# EAGLE design remote_0.1 (EAGLE 7.7.0)
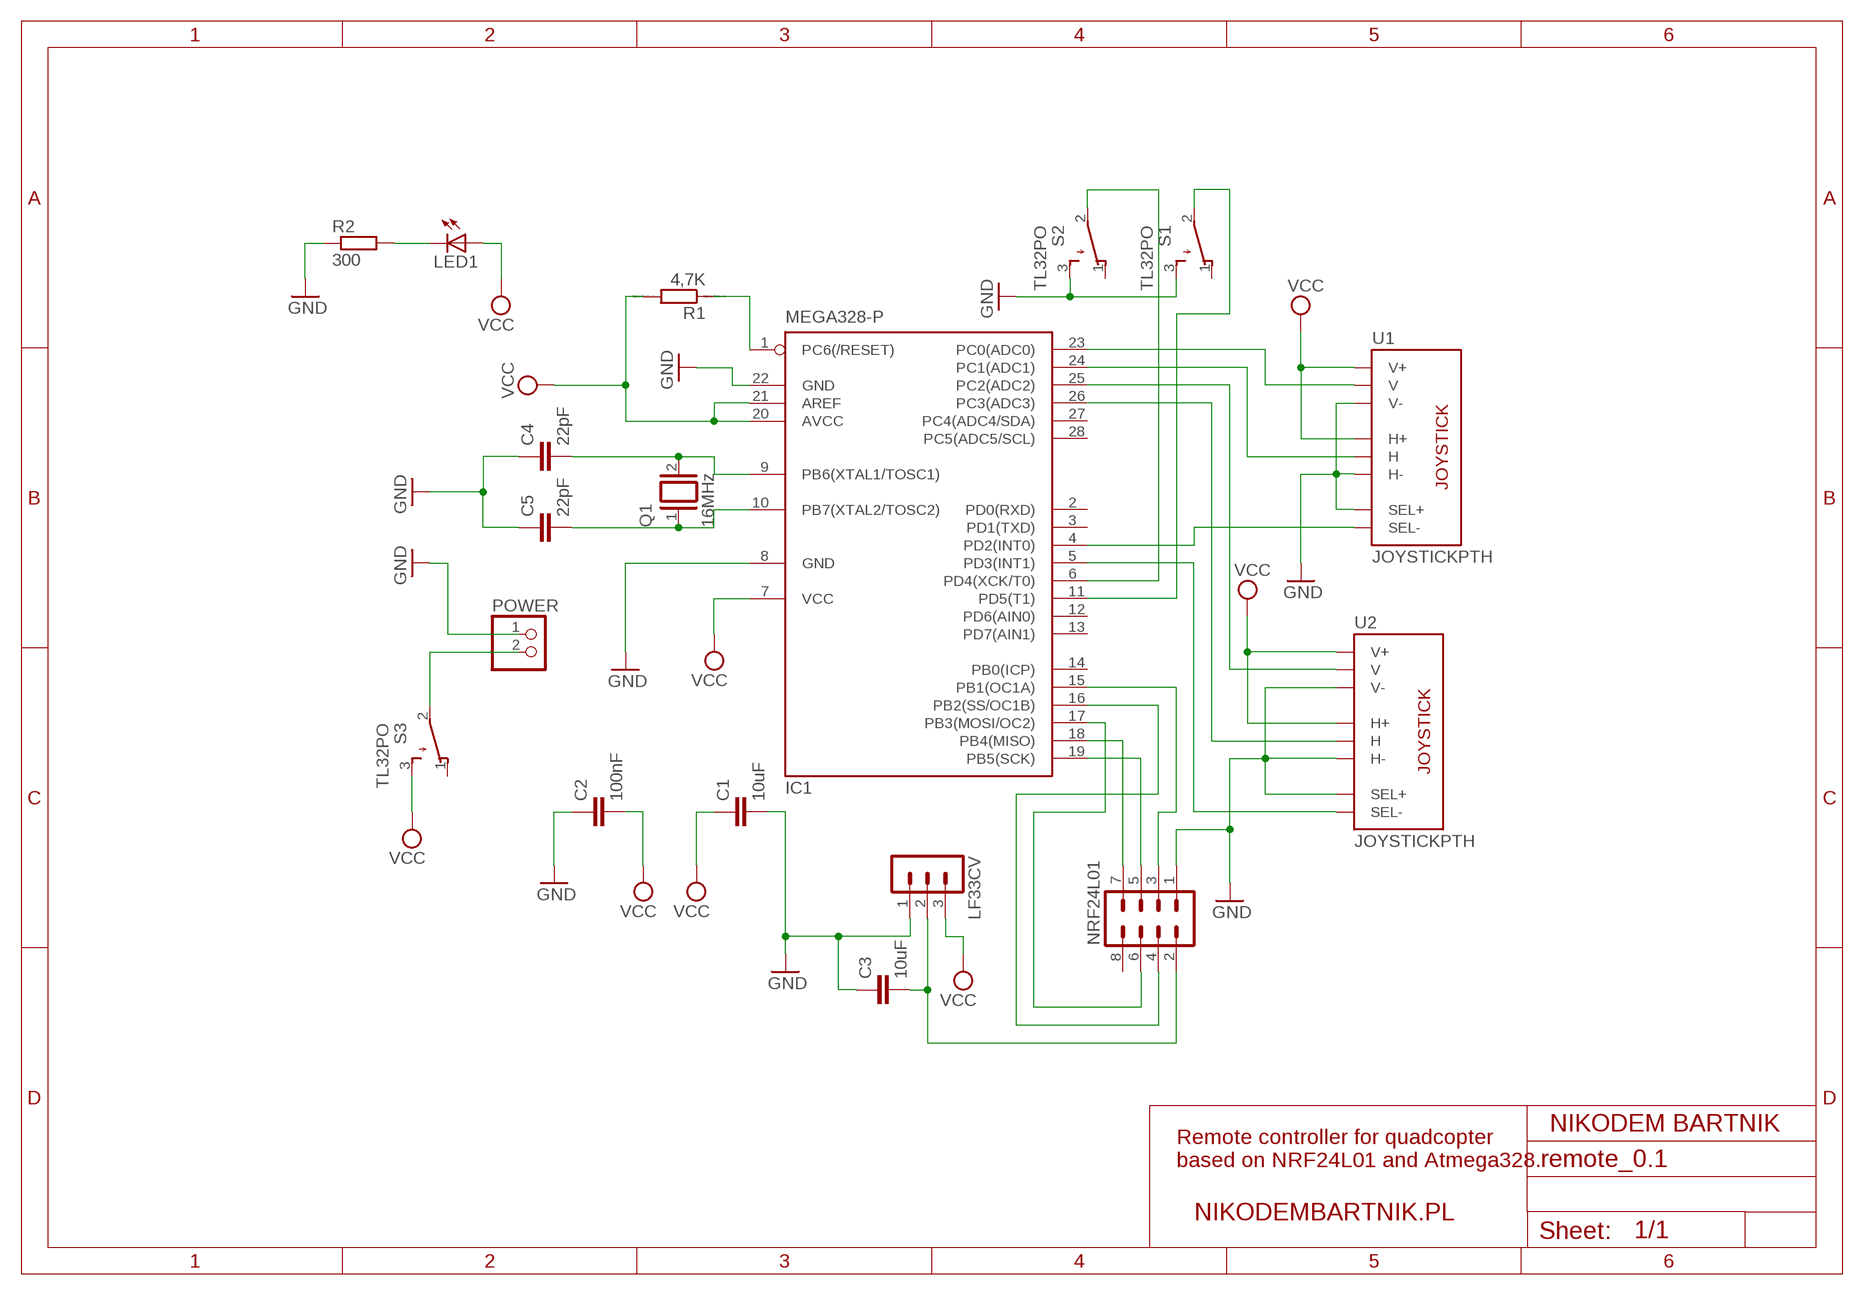
[diagram p0: schematic, sheet 1]

## Parts
C1  10uF  C2,5-3  [C2.5-3]
C2  100nF  C2,5-3  [C2.5-3]
C3  10uF  C2,5-3  [C2.5-3]
C4  22pF  CAPKIT  [CAP-PTH-SMALL-KIT]
C5  22pF  CAPKIT  [CAP-PTH-SMALL-KIT]
IC1  MEGA328-P  MEGA8-P  [DIL28-3]
LED1  LED5MM  [LED5MM]
LF33CV  MA03-1  [MA03-1]
NRF24L01  MA04-2  [MA04-2]
POWER  PINHD-1X2  [1X02]
Q1  16MHz  XTAL/S  [QS]
R1  4,7K  R0204/7  [0204/7]
R2  300  R-EU_0204/5  [0204/5]
S1  TL32PO  [TL3XPO]
S2  TL32PO  [TL3XPO]
S3  TL32PO  [TL3XPO]
U1  JOYSTICKPTH  [JOYSTICK]
U2  JOYSTICKPTH  [JOYSTICK]

## Nets
GND: C1.2 C2.1 C3.1 C4.1 C5.1 IC1.8(GND) IC1.22(GND) LF33CV.1 NRF24L01.1 POWER.1 R2.1 S1.3(S) S2.3(S) U1.B1A(SEL+) U1.H3(H-) U1.V3(V-) U2.B1A(SEL+) U2.H3(H-) U2.V3(V-)
N$1: C4.2 IC1.9(PB6(XTAL1/TOSC1)) Q1.2
N$2: C5.2 IC1.10(PB7(XTAL2/TOSC2)) Q1.1
N$3: IC1.23(PC0(ADC0)) U1.V2(V)
N$4: IC1.24(PC1(ADC1)) U1.H2(H)
N$5: IC1.1(PC6(/RESET)) R1.1
N$6: IC1.18(PB4(MISO)) NRF24L01.7
N$7: IC1.25(PC2(ADC2)) U2.V2(V)
N$8: IC1.26(PC3(ADC3)) U2.H2(H)
N$9: IC1.4(PD2(INT0)) U1.B2A(SEL-)
N$10: IC1.5(PD3(INT1)) U2.B2A(SEL-)
N$11: IC1.15(PB1(OC1A)) NRF24L01.3
N$12: IC1.16(PB2(SS/OC1B)) NRF24L01.4
N$13: IC1.19(PB5(SCK)) NRF24L01.5
N$14: IC1.17(PB3(MOSI/OC2)) NRF24L01.6
N$15: POWER.2 S3.2(P)
N$16: C3.2 LF33CV.2 NRF24L01.2
N$17: IC1.6(PD4(XCK/T0)) S2.2(P)
N$18: IC1.11(PD5(T1)) S1.2(P)
N$19: LED1.K(C) R2.2
VCC: C1.1 C2.2 IC1.7(VCC) IC1.20(AVCC) IC1.21(AREF) LED1.A LF33CV.3 R1.2 S3.3(S) U1.H1(H+) U1.V1(V+) U2.H1(H+) U2.V1(V+)
Unconnected: IC1.2(PD0(RXD)) IC1.3(PD1(TXD)) IC1.12(PD6(AIN0)) IC1.13(PD7(AIN1)) IC1.14(PB0(ICP)) IC1.27(PC4(ADC4/SDA)) IC1.28(PC5(ADC5/SCL)) NRF24L01.8 S1.1(O) S2.1(O) S3.1(O)

## Notes on the sheet
- NIKODEM BARTNIK
- Remote controller for quadcopter
  based on NRF24L01 and Atmega328.
- NIKODEMBARTNIK.PL

## Library data of the parts
C1-C3 = capacitor-wima:C: CAPACITOR naming: grid - package width
C4 C5 = SparkFun-Passives:CAP: Capacitor Standard 0603 ceramic capacitor, and 0.1" leaded capacitor.
IC1 = atmel:MEGA8-P: MICROCONTROLLER 8 Kbytes FLASH, 1 kbytes SRAM, 512 bytes EEPROM, USART, 4-channel 10 bit ADC, 2-channel 8 bit ADC Pin compatible with Atmega48, ATMega88, ATMega168 Source: avr.lbr; OC_FARNELL: unknown; OC_NEWARK: unknown
LED1 = led:LED: LED OSRAM: - CHIPLED LG R971, LG N971, LY N971, LG Q971, LY Q971, LO R971, LY R971 LH N974, LH R974 LS Q976, LO Q976, LY Q976 LO Q996 - Hyper CHIPLED LW Q18S LB Q993, LB Q99A, LB R99A - SideLED LS A670, LO A670, LY A670, LG A670, LP A670 LB A673, LV A673, LT A673, LW A673 LH A674 LY A675 LS A676, LA A676, LO A676, LY A676, LW A676 LS A679, LY A679, LG A679 - Hyper Micro SIDELED® LS Y876, LA Y876, LO Y876, LY Y876 LT Y87S - SmartLED LW L88C, LW L88S LB L89C, LB L89S, LG L890 LS L89K, LO L89K, LY L89K LS L896, LA L896, LO L896, LY L896 - TOPLED LS T670, LO T670, LY T670, LG T670, LP T670 LSG T670, LSP T670, LSY T670, LOP T670, LYG T670 LG T671, LOG T671, LSG T671 LB T673, LV T673, LT T673, LW T673 LH T674 LS T676, LA T676, LO T676, LY T676, LB T676, LH T676, LSB T676, LW T676 LB T67C, LV T67C, LT T67C, LS T67K, LO T67K, LY T67K, LW E67C LS E67B, LA E67B, LO E67B, LY E67B, LB E67C, LV E67C, LT E67C LW T67C LS T679, LY T679, LG T679 LS T770, LO T770, LY T770, LG T770, LP T770 LB T773, LV T773, LT T773, LW T773 LH T774 LS E675, LA E675, LY E675, LS T675 LS T776, LA T776, LO T776, LY T776, LB T776 LHGB T686 LT T68C, LB T68C - Hyper Mini TOPLED® LB M676 - Mini TOPLED Santana® LG M470 LS M47K, LO M47K, LY M47K Source: http://www.osram.convergy.de LUXEON: - LUMILED® LXK2-PW12-R00, LXK2-PW12-S00, LXK2-PW14-U00, LXK2-PW14-V00 LXK2-PM12-R00, LXK2-PM12-S00, LXK2-PM14-U00 LXK2-PE12-Q00, LXK2-PE12-R00, LXK2-PE12-S00, LXK2-PE14-T00, LXK2-PE14-U00 LXK2-PB12-K00, LXK2-PB12-L00, LXK2-PB12-M00, LXK2-PB14-N00, LXK2-PB14-P00, LXK2-PB14-Q00 LXK2-PR12-L00, LXK2-PR12-M00, LXK2-PR14-Q00, LXK2-PR14-R00 LXK2-PD12-Q00, LXK2-PD12-R00, LXK2-PD12-S00 LXK2-PH12-R00, LXK2-PH12-S00 LXK2-PL12-P00, LXK2-PL12-Q00, LXK2-PL12-R00 Source: www.luxeon.com KINGBRIGHT: KA-3528ASYC Source: www.kingbright.com
LF33CV = con-lstb:MA03-1: PIN HEADER; OC_FARNELL: unknown; OC_NEWARK: unknown
NRF24L01 = con-lstb:MA04-2: PIN HEADER; OC_FARNELL: unknown; OC_NEWARK: unknown
POWER = pinhead:PINHD-1X2: PIN HEADER
Q1 = special:XTAL/S: CRYSTAL
R1 = eagle-ltspice:R: RESISTOR, European symbol; SPICEMODEL: NONE; SPICEPREFIX: R
R2 = resistor:R-EU_: RESISTOR, European symbol
S1-S3 = switch:TL32PO: TINY SWITCH ON - MOM Source: http://www2.produktinfo.conrad.com/datenblaetter/700000-724999/705152-da-01-de-Subminiaturschalter_TL_36YO.pdf
U1 U2 = SparkFun-Electromechanical:JOYSTICK: Thumb Joystick Joystick commonly found in PS2 controllers. Two pots and a select switch. Footprint proven. Spark Fun Electronics SKU : COM-09032

## Net classes
0 default: width 0.254 mm, clearance 0.381 mm

## Board
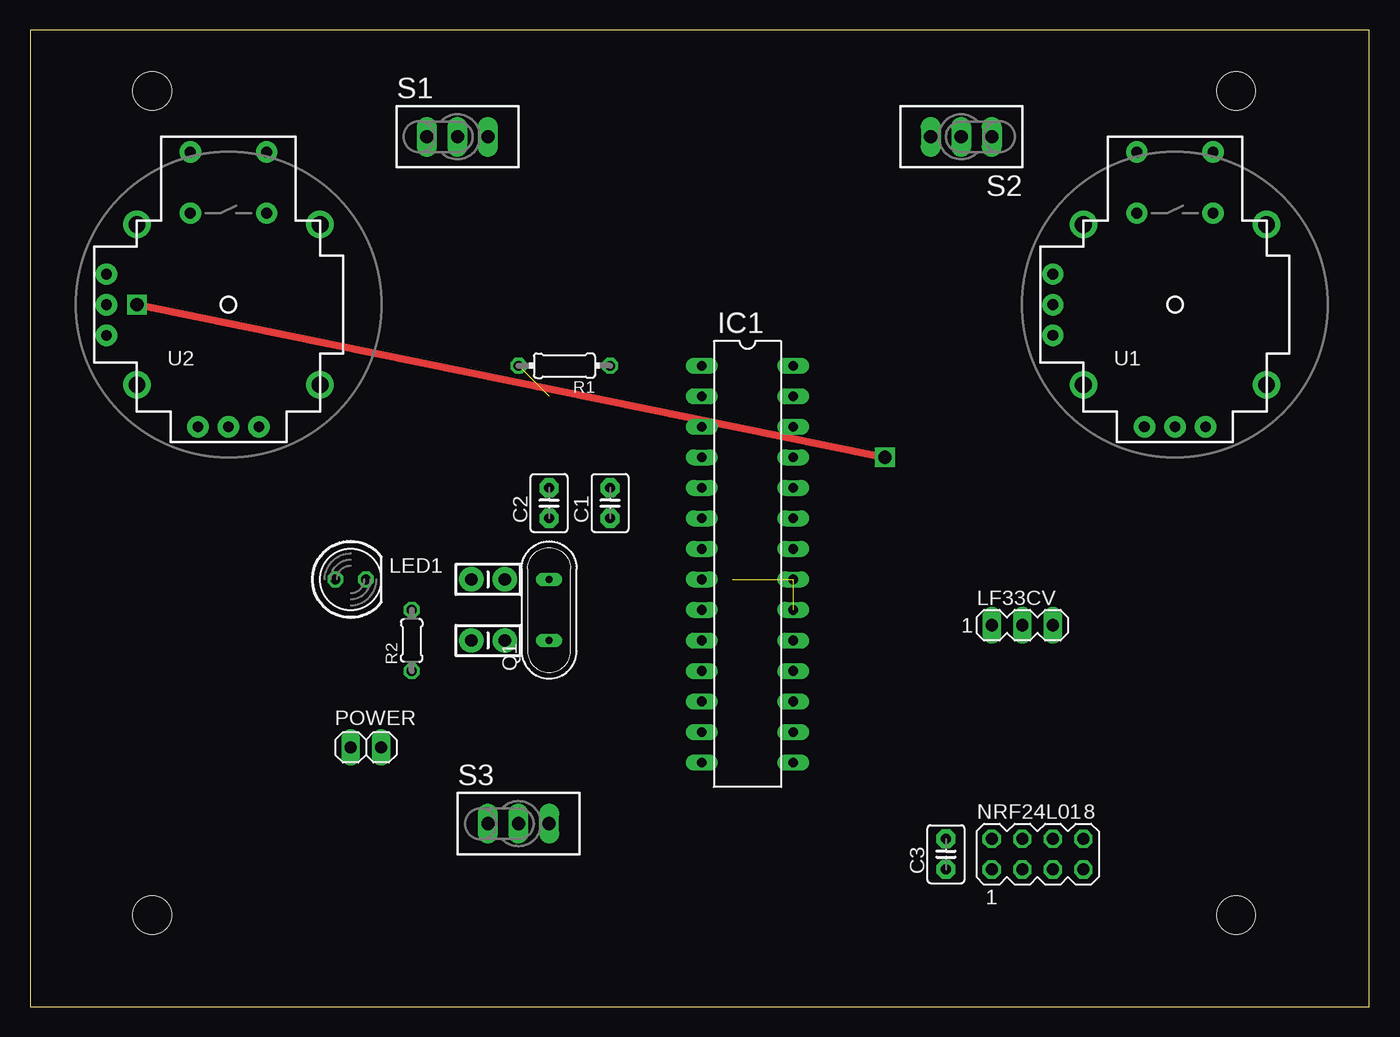
[diagram p1: board, top side]
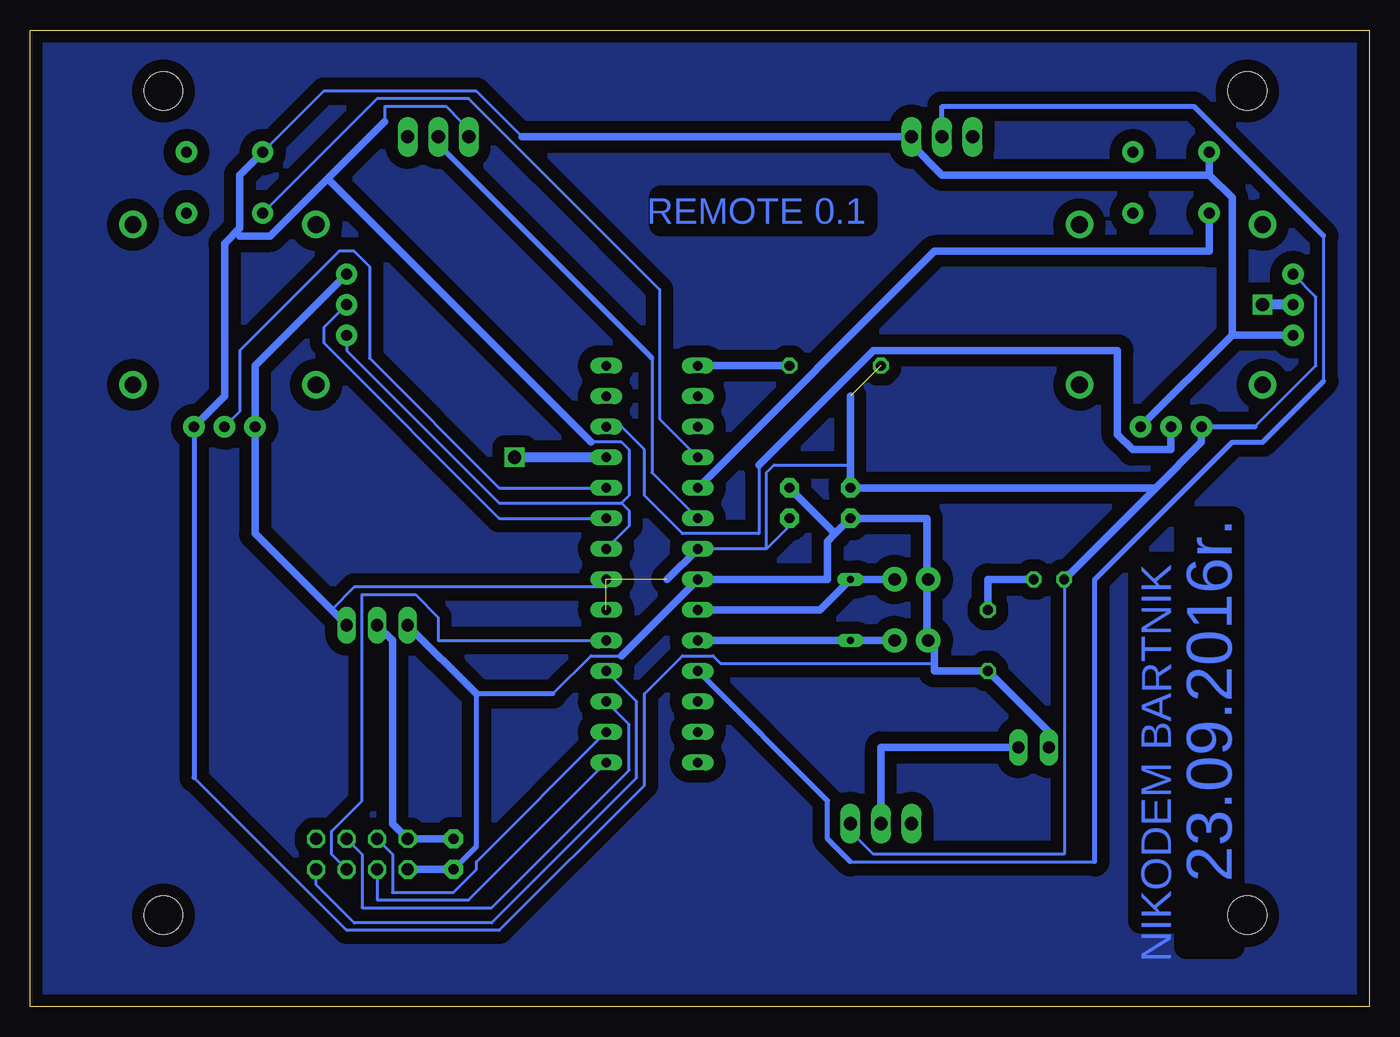
[diagram p2: board, bottom side, seen from below]

Size 111.43 x 81.27 mm. Coordinates in mm from the lower left corner, seen from the top.
Outline: 0,0 111.43,0 111.43,81.27 0,81.27 0,0
Copper layers (1*16): Top 0.035mm / dielectric 1.5mm / Bottom 0.035mm
Design rules "default": minimum track width 10mil, minimum drill 24mil, track to track 8mil, track to pad 8mil, pad to pad 8mil, via to via 8mil, smd to smd 8mil, copper to edge 40mil, drill to drill 8mil, minimum pad ring 10mil, minimum via ring 8mil, stop-mask expansion 4mil, vias tented up to drill 0mil, thermal gap 10mil
Holes 3.2 mm at 10.16,7.62 10.16,76.2 100.33,76.2 100.33,7.62

### Footprints (pad centres in the part's own frame; a part is rotated, then mirrored left to right if it is on the bottom)
C2.5-3 = drill 0.813 pad 1.6 octagon: 1 -1.27,0; 2 1.27,0
CAP-PTH-SMALL-KIT = drill 1.016 pad 2.032: 1 -1.397,0; 2 1.397,0
DIL28-3 = drill 0.813 long: 1 -16.51,-3.81; 2 -13.97,-3.81; 3 -11.43,-3.81; 4 -8.89,-3.81; 5 -6.35,-3.81; 6 -3.81,-3.81; 7 -1.27,-3.81; 8 1.27,-3.81; 9 3.81,-3.81; 10 6.35,-3.81; 11 8.89,-3.81; 12 11.43,-3.81; 13 13.97,-3.81; 14 16.51,-3.81; 15 16.51,3.81; 16 13.97,3.81; 17 11.43,3.81; 18 8.89,3.81; 19 6.35,3.81; 20 3.81,3.81; 21 1.27,3.81; 22 -1.27,3.81; 23 -3.81,3.81; 24 -6.35,3.81; 25 -8.89,3.81; 26 -11.43,3.81; 27 -13.97,3.81; 28 -16.51,3.81
LED5MM = drill 0.813 octagon: A -1.27,0; K 1.27,0
MA03-1 = drill 1.016 long: 1 -2.54,0; 2 0,0; 3 2.54,0
MA04-2 = drill 1.016 octagon: 1 -3.81,-1.27; 2 -3.81,1.27; 3 -1.27,-1.27; 4 -1.27,1.27; 5 1.27,-1.27; 6 1.27,1.27; 7 3.81,-1.27; 8 3.81,1.27
1X02 = drill 1.016 long: 1 -1.27,0; 2 1.27,0
QS = drill 0.61 long: 1 -2.54,0; 2 2.54,0
0204/7 = drill 0.813 octagon: 1 -3.81,0; 2 3.81,0
0204/5 = drill 0.813 octagon: 1 -2.54,0; 2 2.54,0
TL3XPO = drill 1.1 pad 1.422 long: 1 -2.54,0; 2 0,0; 3 2.54,0
JOYSTICK = drill 0.9 pad 1.778: B1A -3.175,12.7; B1B 3.175,12.7; B2A -3.175,7.62; B2B 3.175,7.62 | drill 0.889 pad 1.778: H1 -2.54,-10.16; H2 0,-10.16; H3 2.54,-10.16; V1 -10.16,2.54; V2 -10.16,0; V3 -10.16,-2.54 | drill 1.397 pad 2.286: MOUNT1 -7.62,6.668; MOUNT2 -7.62,-6.668; MOUNT3 7.62,-6.668; MOUNT4 7.62,6.668

### Placement (x,y rotation side)
C1  48.26,41.91 90 top
C2  43.18,41.91 90 top
C3  76.2,12.7 90 top
C4  38.1,35.56 0 top
C5  38.1,30.48 0 top
IC1  59.69,36.83 270 top
LED1  26.67,35.56 0 top
LF33CV  82.55,31.75 0 top
NRF24L01  83.82,12.7 0 top
POWER  27.94,21.59 0 top
Q1  43.18,33.02 90 top
R1  44.45,53.34 180 top
R2  31.75,30.48 90 top
S1  35.56,72.39 0 top
S2  77.47,72.39 180 top
S3  40.64,15.24 0 top
U1  95.25,58.42 0 top
U2  16.51,58.42 0 top

### Tracks (layer width: path | path; a pad name or v marks a point on that pad's centre or on a via)
GND
  Bottom 0.254: 36.83,30.48 C5.1 | 36.83,35.56 C4.1 | IC1.22 61.6,40.01 61.6,41.27 62.23,41.91 | S2.3 75.56,73.03 75.56,73.66 76.83,74.93 81.91,74.93 81.91,73.66 | 93.98,64.77 93.98,64.14 | 62.23,41.91 61.6,42.55 61.6,46.35 62.23,46.99 64.77,46.99 | 70.48,72.39 74.3,76.2 86.99,76.2 U1.B1A | 36.2,28.57 53.98,28.57 54.61,29.21 57.15,29.21 60.33,26.04 60.33,18.41 72.39,6.35 85.09,6.35 97.79,19.05 | 62.23,29.21 64.77,29.21 67.94,26.04 | U1.V3 85.09,54.61 72.39,41.91 62.23,41.91
  Bottom 0.406: C3.1 74.3,13.34 74.3,26.04 67.94,26.04 | U1.H3 97.79,19.05
  Bottom 0.61: C3.1 NRF24L01.1 | 74.3,26.04 LF33CV.1 | 44.45,39.37 C2.1 36.83,40.64 36.83,35.56 36.83,30.48 | 44.45,39.37 45.09,38.73 45.09,35.56 IC1.8 62.23,29.21 | 44.45,39.37 C1.2 | C5.1 36.2,30.48 36.2,28.57 36.2,27.94 R2.1 26.67,22.86 POWER.1 | 11.43,55.88 U2.H3 | U2.V3 11.43,55.88 | 13.33,69.22 35.56,69.22 38.1,71.75 S1.3 70.48,72.39 | U2.B1A 13.33,69.22 | 11.43,55.88 11.43,67.31 13.33,69.22 | 93.98,64.14 91.44,64.14 86.68,68.9 | U1.B1A 93.98,69.22 93.98,64.77 95.25,63.5 95.25,50.8 U1.H3 | 81.91,73.66 86.68,68.9 | 64.77,46.99 86.68,68.9
N$1
  Bottom 0.61: IC1.9 45.72,33.02 Q1.2 C4.2
N$2
  Bottom 0.61: IC1.10 Q1.1 C5.2
N$3
  Bottom 0.254: U1.V2 86.99,56.52 86.99,55.24 72.39,40.64 IC1.23
N$4
  Bottom 0.254: U1.H2 93.98,49.53 93.98,54.61 85.72,62.87 84.45,62.87 83.19,61.59 83.19,53.98 72.39,43.18 IC1.24
N$5
  Bottom 0.61: IC1.1 R1.1
N$6
  Bottom 0.254: IC1.18 60.96,25.4 60.96,19.05 73.02,6.99 84.45,6.99 87.63,10.16 NRF24L01.7
N$7  (2 unrouted)
  Top 0.61: 8.89,58.42 71.12,45.72
  Bottom 0.813: IC1.25 71.12,45.72 | U2.V2 8.89,58.42
N$8
  Bottom 0.254: 50.8,45.09 50.8,39.37 57.15,39.37 60.33,42.55 60.33,46.35 62.23,48.26 IC1.26
  Bottom 0.61: 50.8,45.09 41.28,54.61 20.95,54.61 20.95,47.62 19.68,46.35 16.51,46.35 U2.H2
N$9
  Bottom 0.254: IC1.4 59.05,48.9 59.05,59.69 74.93,75.56 82.55,75.56 U1.B2A
N$10
  Bottom 0.61: IC1.5 36.2,62.87 13.33,62.87 U2.B2A
N$11
  Bottom 0.254: IC1.15 74.93,8.89 82.55,8.89 NRF24L01.3
N$12
  Bottom 0.254: IC1.16 74.3,12.06 74.3,11.43 76.2,9.53 81.28,9.53 81.28,12.7 NRF24L01.4
N$13
  Bottom 0.254: IC1.19 77.47,30.48 77.47,32.38 79.38,34.29 83.82,34.29 83.82,17.14 86.36,14.61 86.36,12.7 NRF24L01.5
N$14
  Bottom 0.254: IC1.17 61.6,23.5 61.6,19.68 73.02,8.26 83.82,8.26 83.82,12.7 NRF24L01.6
N$15
  Bottom 0.61: POWER.2 40.64,21.59 S3.2
N$16
  Bottom 0.61: C3.2 NRF24L01.2 81.28,15.24 81.28,30.48 LF33CV.2
N$17
  Bottom 0.254: IC1.6 59.69,44.45 59.69,53.98
  Bottom 0.406: 59.69,53.98 77.47,71.75 S2.2
N$18
  Bottom 0.254: 43.18,12.06 22.86,12.06 | 3.81,52.07 3.81,64.14
  Bottom 0.406: IC1.11 45.09,17.14 45.09,13.97 43.18,12.06 | 3.81,64.14 14.61,74.93 35.56,74.93 S1.2 | 22.86,12.06 22.86,35.56 11.43,46.99 8.89,46.99 3.81,52.07
N$19
  Bottom 0.61: LED1.K 31.75,35.56 R2.2
N$20  (via drill 1.1 pad 1.42)
  other vias: 71.12,45.72
N$21  (via drill 1.1 pad 1.42)
  other vias: 8.89,58.42
N$22
  pour Bottom (isolate 1.016): 0,81.28 0,0 111.76,0 111.76,81.28
VCC  (4 unrouted)
  Bottom 0.254: 50.17,38.1 IC1.7 | 43.18,45.09 49.53,45.09 50.17,44.45 50.17,38.1 | 86.36,33.02 84.45,34.92 63.5,34.92 | LED1.A 25.4,12.7 41.28,12.7 43.18,14.61 S3.3 | U2.V1 4.45,59.05 4.45,53.34 9.53,48.26 | C1.1 48.26,40.01 50.17,38.1
  Bottom 0.406: U2.H1 9.53,48.26
  Bottom 0.61: LF33CV.3 86.36,33.02 92.71,39.37 U1.H1 92.71,53.34 U1.V1 | 43.18,50.8 43.18,45.09 C2.2 17.78,43.18 | IC1.7 58.42,35.56 | 17.78,43.18 13.97,46.99 U2.H1 | 17.78,43.18 LED1.A

### Text on the board
Bottom: REMOTE 0.1 | 23.09.2016r. | NIKODEM BARTNIK